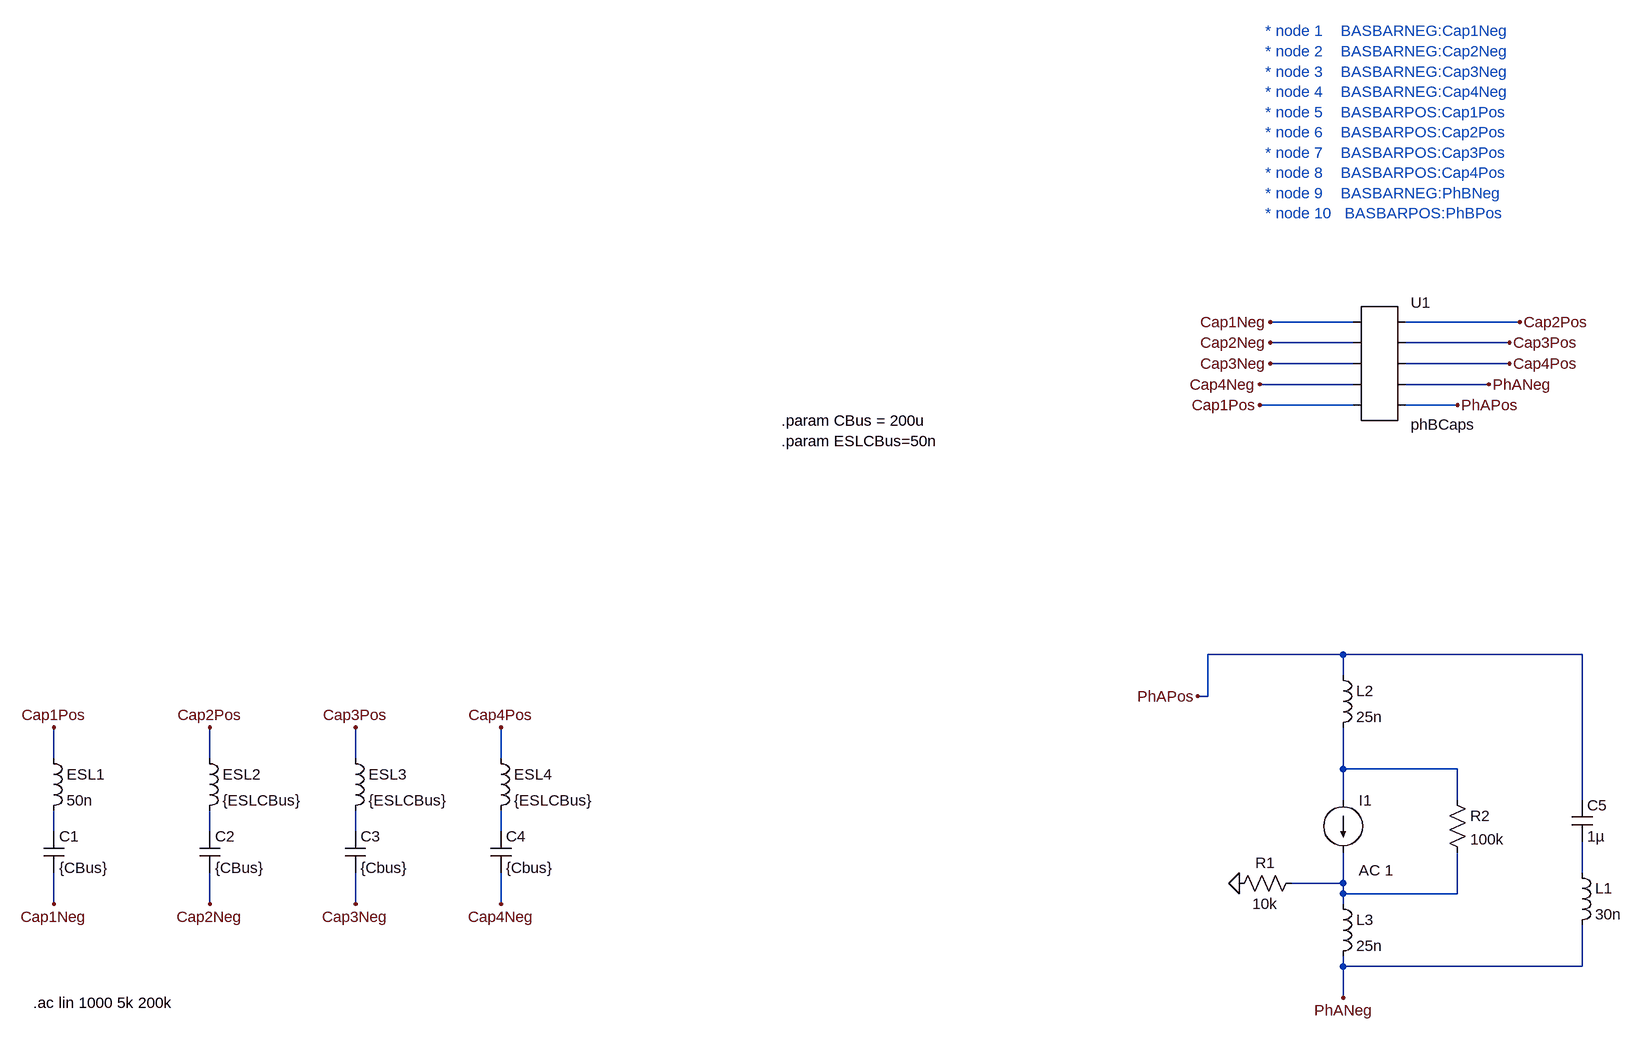
[diagram p0: schematic PhBResponse.asc]
* PhBResponse.asc
C1 N002 Cap1Neg {CBus} Rser=2m
L§ESL1 Cap1Pos N002 50n
C2 N003 Cap2Neg {CBus} Rser=2m
L§ESL2 Cap2Pos N003 {ESLCBus}
C3 N004 Cap3Neg {Cbus} Rser=2m
L§ESL3 Cap3Pos N004 {ESLCBus}
C4 N005 Cap4Neg {Cbus} Rser=2m
L§ESL4 Cap4Pos N005 {ESLCBus}
I1 N001 N007 AC 1
R1 N007 0 10k
R2 N001 N007 100k
C5 PhAPos N006 1µ
L1 N006 PhANeg 30n
L2 PhAPos N001 25n
L3 N007 PhANeg 25n
* U1: phBCaps (symbol AutoGenerated\phBCaps not available, pins judged from their places): pin1=Cap1Neg pin2=Cap2Neg pin3=Cap3Neg pin4=Cap4Neg pin5=Cap1Pos pin6=Cap2Pos pin7=Cap3Pos pin8=Cap4Pos pin9=PhANeg pin10=PhAPos
.param CBus = 200u
.param ESLCBus=50n
* * node 1    BASBARNEG:Cap1Neg
* * node 2    BASBARNEG:Cap2Neg
* * node 3    BASBARNEG:Cap3Neg
* * node 4    BASBARNEG:Cap4Neg
* * node 5    BASBARPOS:Cap1Pos
* * node 6    BASBARPOS:Cap2Pos
* * node 7    BASBARPOS:Cap3Pos
* * node 8    BASBARPOS:Cap4Pos
* * node 9    BASBARNEG:PhBNeg
* * node 10   BASBARPOS:PhBPos
.ac lin 1000 5k 200k
.backanno
.end

* Results of the author's LTspice run, read from the files saved beside the schematic
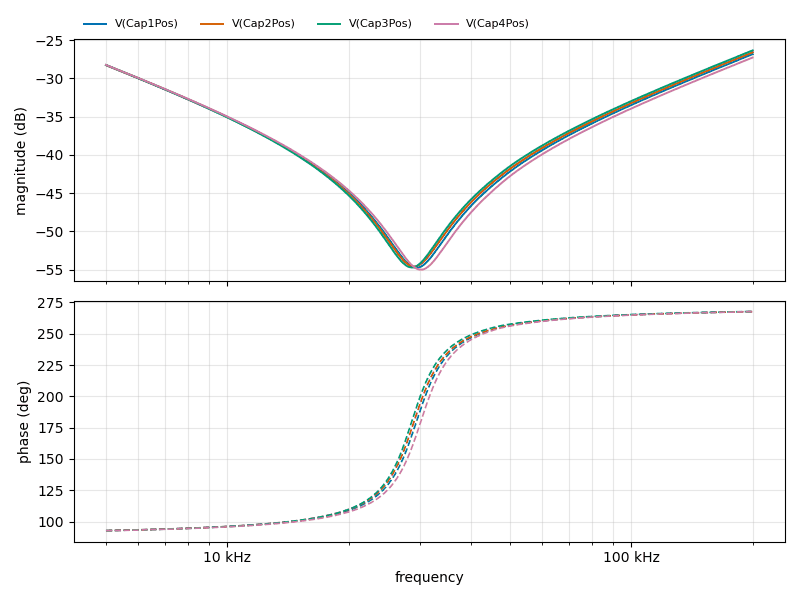
[diagram p1: AC Analysis of PhBResponse.asc, plotted from the saved traces]
* AC Analysis, 1 run:
*   V(Cap1Pos): -28.26 dB at 5 kHz, -26.84 dB at 200 kHz, peak -26.84 dB at 200 kHz, 3 dB below the peak at 144.9 kHz
*   V(Cap2Pos): -28.27 dB at 5 kHz, -26.60 dB at 200 kHz, peak -26.60 dB at 200 kHz, 3 dB below the peak at 144.8 kHz
*   V(Cap3Pos): -28.28 dB at 5 kHz, -26.35 dB at 200 kHz, peak -26.35 dB at 200 kHz, 3 dB below the peak at 144.8 kHz
*   V(Cap4Pos): -28.25 dB at 5 kHz, -27.28 dB at 200 kHz, peak -27.28 dB at 200 kHz, 3 dB below the peak at 144.9 kHz